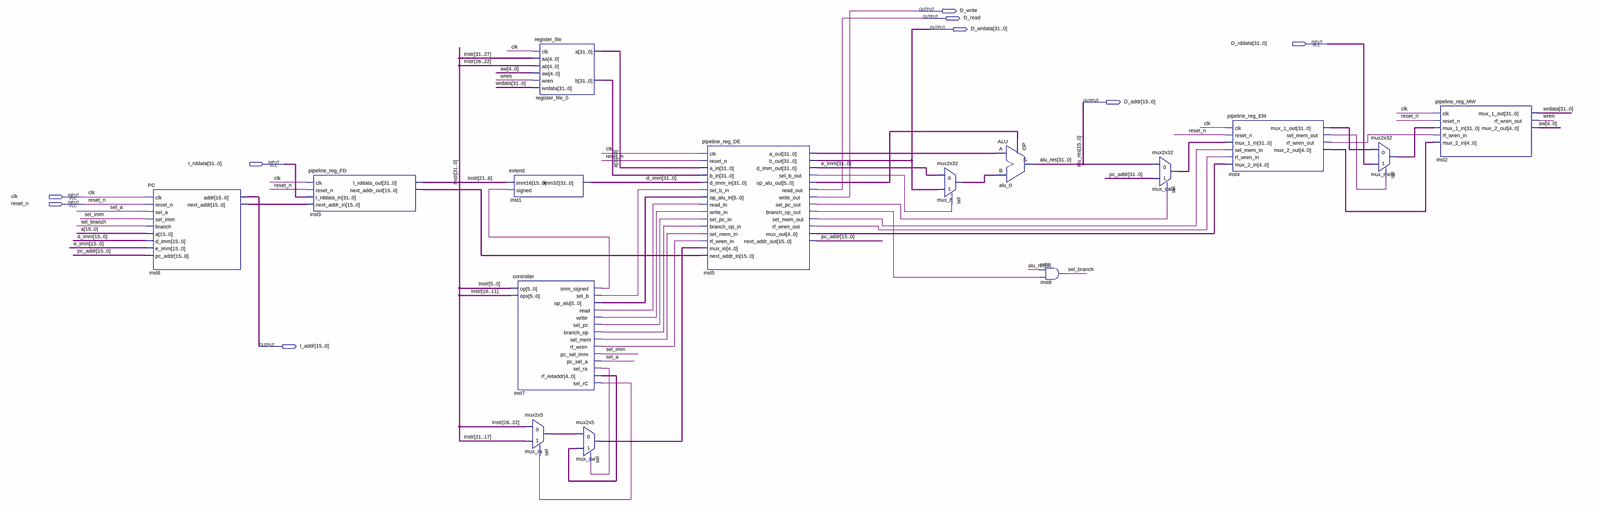
[diagram p0: schematic sheet, whole]
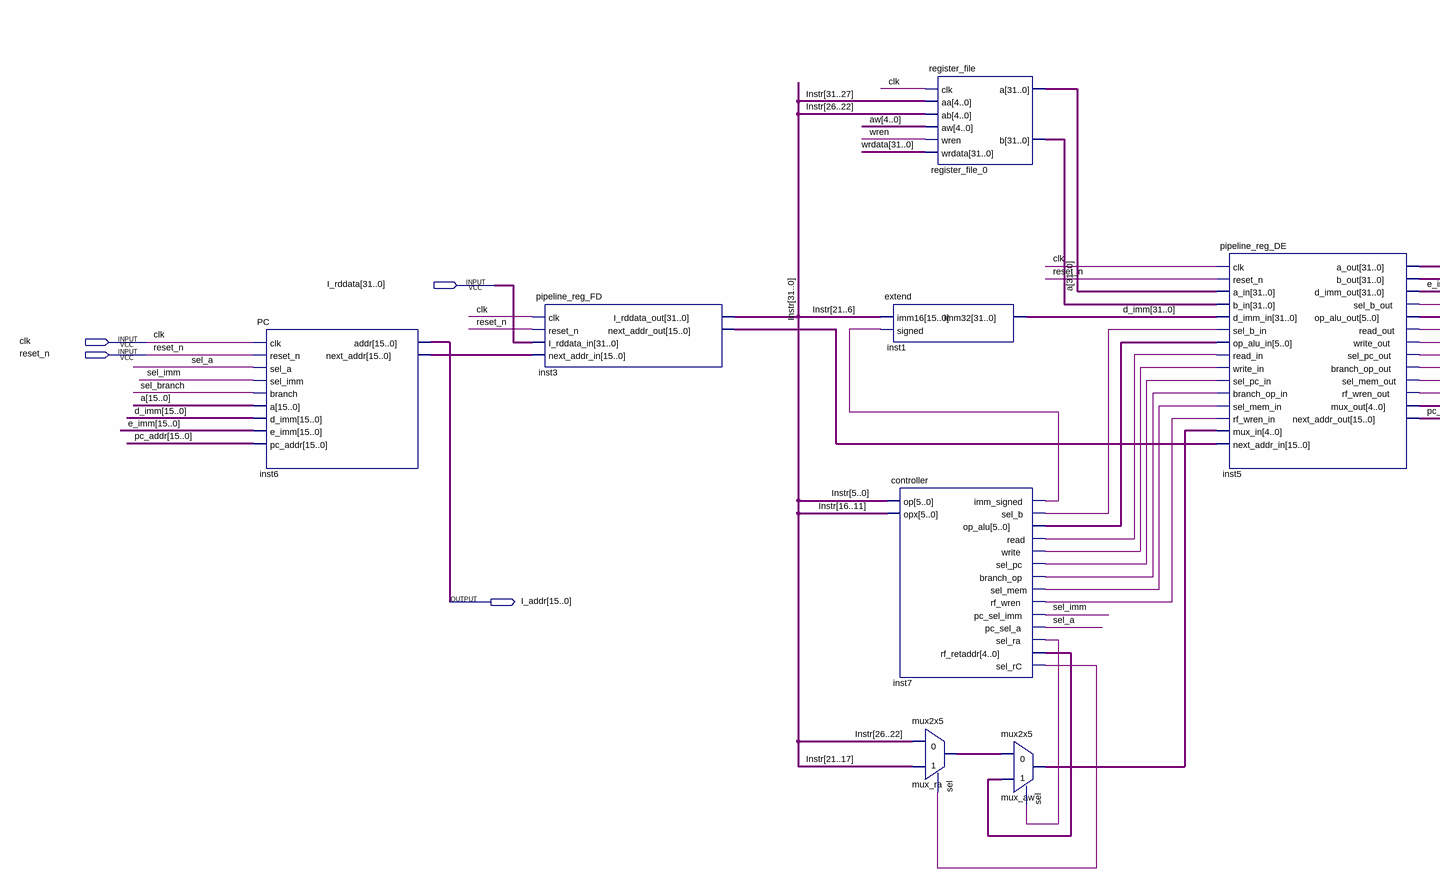
[diagram p1: schematic sheet, left part]
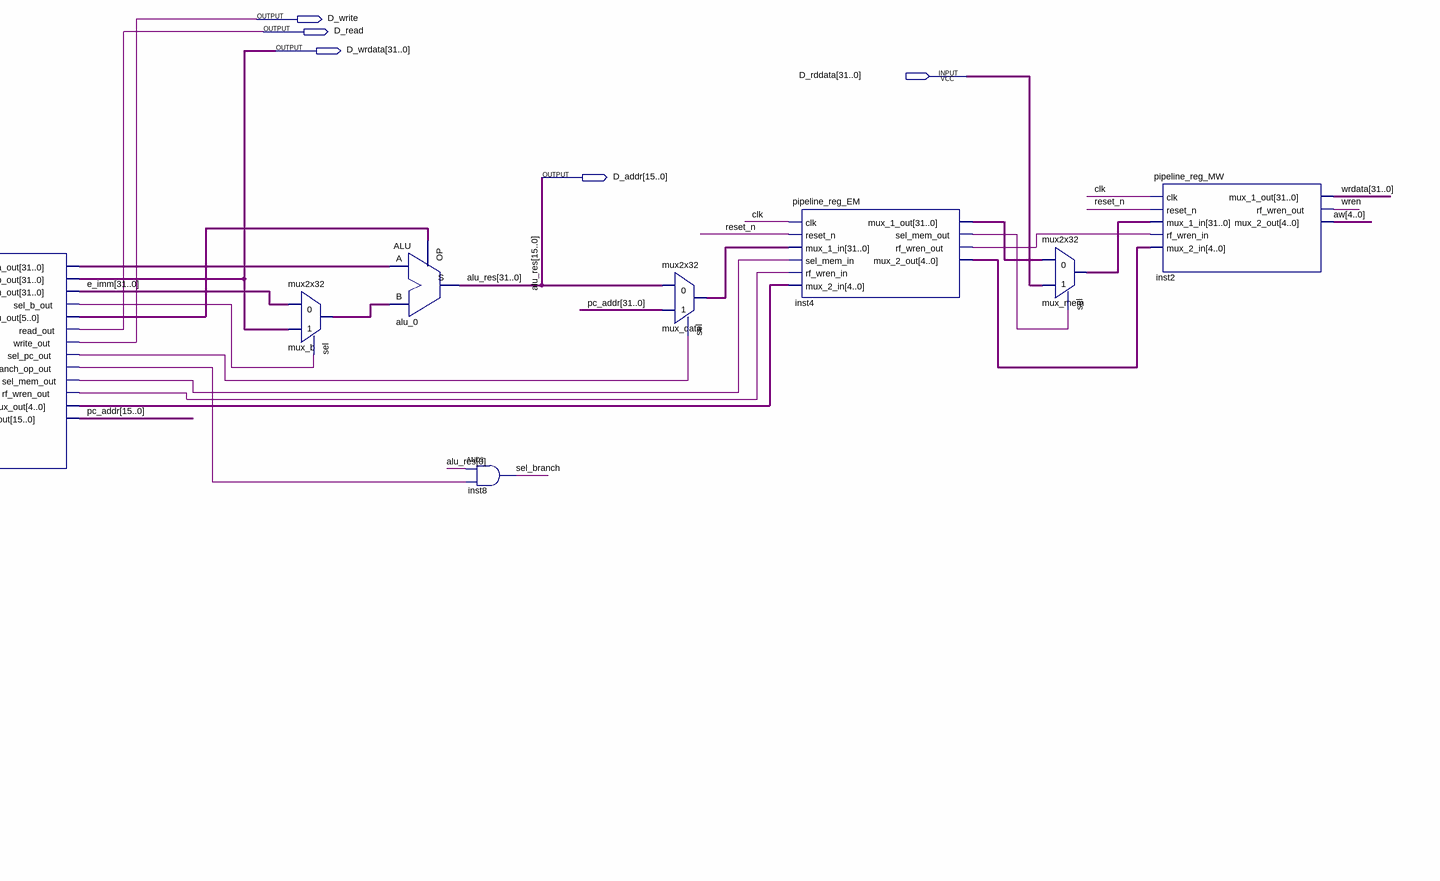
[diagram p2: schematic sheet, right part]
// Quartus schematic CPU.bdf as structural Verilog: 15 symbols, 9 pins
module CPU (
  input  [31:0] D_rddata,
  input  [31:0] I_rddata,
  input  clk,
  input  reset_n,
  output D_write,
  output D_read,
  output [31:0] D_wrdata,
  output [15:0] D_addr,
  output [15:0] I_addr
);

  wire inst4_rf_wren_out, inst4_sel_mem_out, inst5_branch_op_out, inst5_rf_wren_out, inst5_sel_b_out,
       inst5_sel_mem_out, inst5_sel_pc_out, inst7_branch_op, inst7_imm_signed, inst7_read, inst7_rf_wren,
       inst7_sel_b, inst7_sel_mem, inst7_sel_pc, inst7_sel_ra, inst7_sel_rc, inst7_write, sel_a, sel_branch,
       sel_imm, wren;
  wire [4:0] aw, inst4_mux_2_out, inst5_mux_out, inst7_rf_retaddr, mux_aw_o, mux_ra_o;
  wire [5:0] inst5_op_alu_out, inst7_op_alu;
  wire [15:0] inst3_next_addr_out, inst6_next_addr;
  wire [31:0] a, d_imm, e_imm, inst4_mux_1_out, inst5_a_out, Instr, mux_b_o, mux_data_o, mux_mem_o, pc_addr,
       register_file_0_b, wrdata;
  wire [31:16] alu_res;

  PC inst6 (
    .clk(clk), .reset_n(reset_n), .sel_a(sel_a), .sel_imm(sel_imm), .branch(sel_branch), .a(a[15:0]),
    .d_imm(d_imm[15:0]), .e_imm(e_imm[15:0]), .pc_addr(pc_addr[15:0]), .addr(I_addr),
    .next_addr(inst6_next_addr));
  pipeline_reg_FD inst3 (
    .clk(clk), .reset_n(reset_n), .I_rddata_in(I_rddata), .next_addr_in(inst6_next_addr),
    .I_rddata_out(Instr), .next_addr_out(inst3_next_addr_out));
  extend inst1 (.imm16(Instr[21:6]), .\signed (inst7_imm_signed), .imm32(d_imm));
  controller inst7 (
    .op(Instr[5:0]), .opx(Instr[16:11]), .imm_signed(inst7_imm_signed), .sel_b(inst7_sel_b),
    .op_alu(inst7_op_alu), .read(inst7_read), .write(inst7_write), .sel_pc(inst7_sel_pc),
    .branch_op(inst7_branch_op), .sel_mem(inst7_sel_mem), .rf_wren(inst7_rf_wren), .pc_sel_imm(sel_imm),
    .pc_sel_a(sel_a), .sel_ra(inst7_sel_ra), .rf_retaddr(inst7_rf_retaddr), .sel_rC(inst7_sel_rc));
  register_file register_file_0 (
    .clk(clk), .aa(Instr[31:27]), .ab(Instr[26:22]), .aw(aw), .wren(wren), .wrdata(wrdata), .a(a),
    .b(register_file_0_b));
  mux2x5 mux_ra (.i0(Instr[26:22]), .i1(Instr[21:17]), .sel(inst7_sel_rc), .o(mux_ra_o));
  mux2x5 mux_aw (.i0(mux_ra_o), .i1(inst7_rf_retaddr), .sel(inst7_sel_ra), .o(mux_aw_o));
  pipeline_reg_DE inst5 (
    .clk(clk), .reset_n(reset_n), .a_in(a), .b_in(register_file_0_b), .d_imm_in(d_imm),
    .sel_b_in(inst7_sel_b), .op_alu_in(inst7_op_alu), .read_in(inst7_read), .write_in(inst7_write),
    .sel_pc_in(inst7_sel_pc), .branch_op_in(inst7_branch_op), .sel_mem_in(inst7_sel_mem),
    .rf_wren_in(inst7_rf_wren), .mux_in(mux_aw_o), .next_addr_in(inst3_next_addr_out), .a_out(inst5_a_out),
    .b_out(D_wrdata), .d_imm_out(e_imm), .sel_b_out(inst5_sel_b_out), .op_alu_out(inst5_op_alu_out),
    .read_out(D_read), .write_out(D_write), .sel_pc_out(inst5_sel_pc_out),
    .branch_op_out(inst5_branch_op_out), .sel_mem_out(inst5_sel_mem_out), .rf_wren_out(inst5_rf_wren_out),
    .mux_out(inst5_mux_out), .next_addr_out(pc_addr[15:0]));
  mux2x32 mux_b (.i0(e_imm), .i1(D_wrdata), .sel(inst5_sel_b_out), .o(mux_b_o));
  ALU alu_0 (.a(inst5_a_out), .b(mux_b_o), .op(inst5_op_alu_out), .s({alu_res, D_addr}));
  and inst8 (sel_branch, D_addr[0], inst5_branch_op_out);
  mux2x32 mux_data (.i0({alu_res, D_addr}), .i1(pc_addr), .sel(inst5_sel_pc_out), .o(mux_data_o));
  pipeline_reg_EM inst4 (
    .clk(clk), .reset_n(reset_n), .mux_1_in(mux_data_o), .sel_mem_in(inst5_sel_mem_out),
    .rf_wren_in(inst5_rf_wren_out), .mux_2_in(inst5_mux_out), .mux_1_out(inst4_mux_1_out),
    .sel_mem_out(inst4_sel_mem_out), .rf_wren_out(inst4_rf_wren_out), .mux_2_out(inst4_mux_2_out));
  mux2x32 mux_mem (.i0(inst4_mux_1_out), .i1(D_rddata), .sel(inst4_sel_mem_out), .o(mux_mem_o));
  pipeline_reg_MW inst2 (
    .clk(clk), .reset_n(reset_n), .mux_1_in(mux_mem_o), .rf_wren_in(inst4_rf_wren_out),
    .mux_2_in(inst4_mux_2_out), .mux_1_out(wrdata), .rf_wren_out(wren), .mux_2_out(aw));

  // Other names for the same wires on the sheet: alu_res[15:0] = D_addr
endmodule
